# Altium schematic sheet MCU_CAN.SchDoc
size A; SheetNumber: 5; SheetTotal: 5
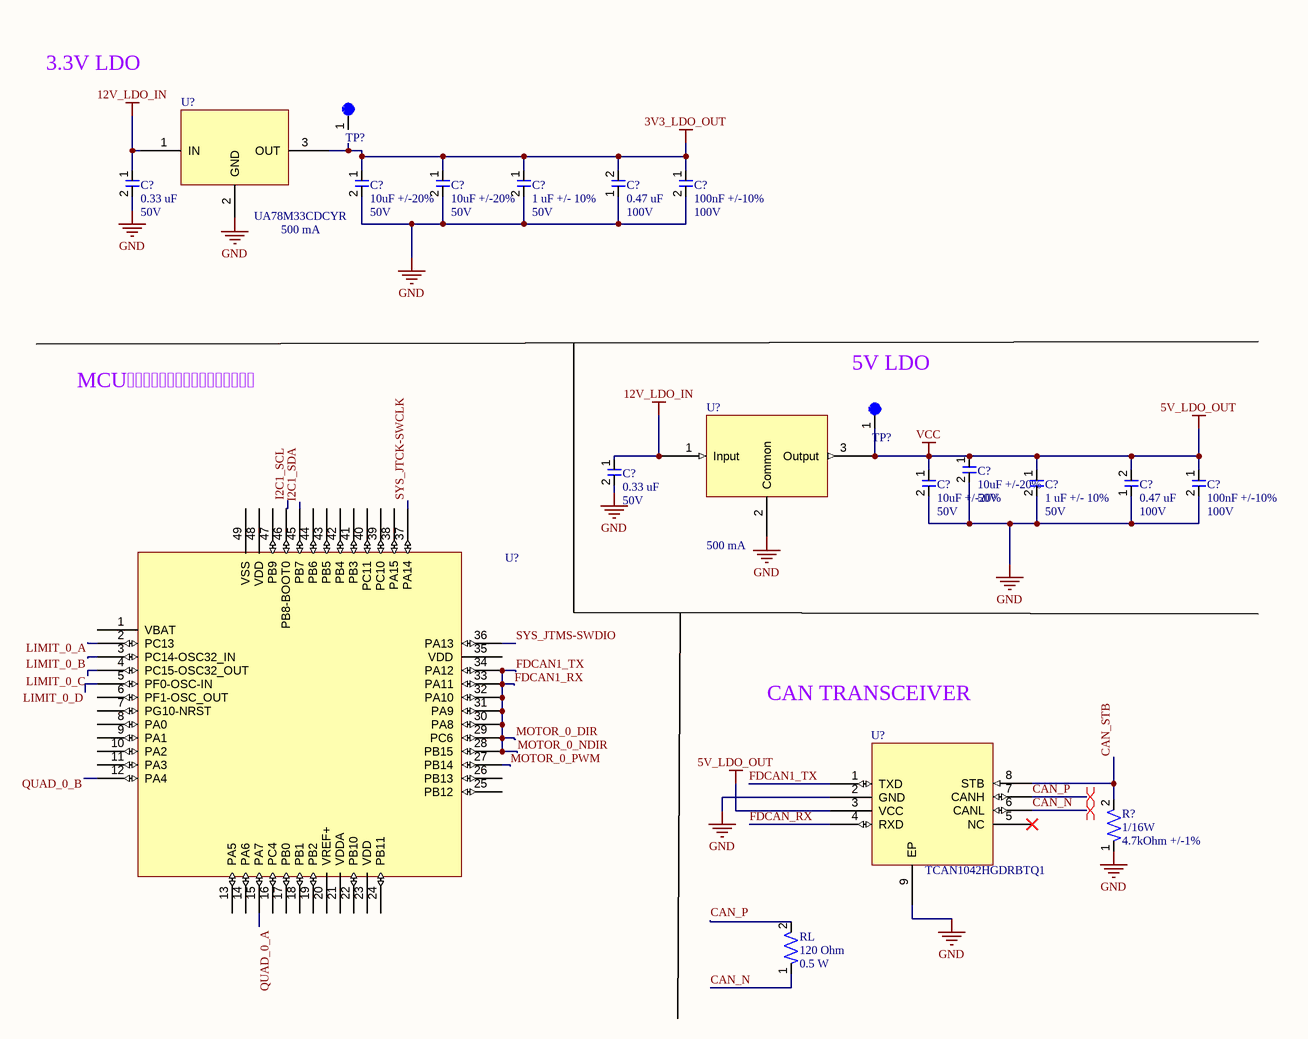
[diagram p0: MCU_CAN.SchDoc]

## Parts
(Parts that share a designator on the sheet are numbered #1, #2 ... from top to bottom, then left to right.)
C?#1  Capacitance: 0.33 uF  Voltage: 50V  [CAP-0603]  (hidden comment: CGA3E3X7R1H334K080AB)
C?#2  Capacitance: 10uF +/-20%  Voltage Rating: 50V  [CAP-1206]  (hidden comment: CL31B106KBHNNNE)
C?#3  Capacitance: 10uF +/-20%  Voltage Rating: 50V  [CAP-1206]  (hidden comment: CL31B106KBHNNNE)
C?#4  Cap: 1 uF +/- 10%  Voltage: 50V  [CAP-0805]  (hidden comment: GCM21BR71H105KA03L)
C?#5  Capacitance: 0.47 uF  Voltage: 100V  [CAP-0805]  (hidden comment: KAM21KR72A474KL)
C?#6  Capacitance: 100nF +/-10%  Voltage Rating: 100V  [CAP-0603]  (hidden comment: CC0603KRX7R0BB104)
C?#7  Capacitance: 0.33 uF  Voltage: 50V  [CAP-0603]  (hidden comment: CGA3E3X7R1H334K080AB)
C?#8  Capacitance: 10uF +/-20%  Voltage Rating: 50V  [CAP-1206]  (hidden comment: CL31B106KBHNNNE)
C?#9  Capacitance: 10uF +/-20%  Voltage Rating: 50V  [CAP-1206]  (hidden comment: CL31B106KBHNNNE)
C?#10  Cap: 1 uF +/- 10%  Voltage: 50V  [CAP-0805]  (hidden comment: GCM21BR71H105KA03L)
C?#11  Capacitance: 0.47 uF  Voltage: 100V  [CAP-0805]  (hidden comment: KAM21KR72A474KL)
C?#12  Capacitance: 100nF +/-10%  Voltage Rating: 100V  [CAP-0603]  (hidden comment: CC0603KRX7R0BB104)
R?  Power Rating: 1/16W  Resistance: 4.7kOhm +/-1%  [RES-0402]  (hidden comment: RC0402FR-074K7P)
RL  Resistance: 120 Ohm  Power: 0.5 W  [RES-1206]  (hidden comment: CRGH1206F120R)
TP?#1  5003  [TEST-POINT-0001]  (value not drawn)
TP?#2  5003  [TEST-POINT-0001]  (value not drawn)
U?#1  UA78M33CDCYR  Current: 500 mA  [IC-SOT-223-4]
U?#2  Current: 500 mA  [IC-SOT-223-4]  (hidden comment: UA78M05IDCYR)
U?#3  STM32G431CBU6  [MCU-UFQFPN48]  (value not drawn)
U?#4  TCAN1042HGDRBTQ1  [IC-8-VSON]

## Nets
3V3_LDO_OUT: C?#2.1 C?#3.1 C?#4.1 C?#5.2 C?#6.1 U?#1.3(OUT)
5V_LDO_OUT: C?#8.1 C?#9.1 C?#10.1 C?#11.2 C?#12.1 TP?#2.1 U?#2.3(Output) U?#4.3(VCC)  [also labelled VCC]
12V_LDO_IN: C?#1.1 C?#7.1 U?#1.1(IN) U?#2.1(Input)
GND: C?#1.2 C?#2.2 C?#3.2 C?#4.2 C?#5.1 C?#6.2 C?#7.2 C?#8.2 C?#9.2 C?#10.2 C?#11.1 C?#12.2 R?.1 U?#1.2(GND) U?#2.2(Common) U?#4.2(GND) U?#4.9(EP)
CAN_N: RL.1 U?#4.6(CANL)
CAN_P: RL.2 U?#4.7(CANH)
CAN_STB: R?.2 U?#4.8(STB)
FDCAN1_RX: U?#3.28(PB15) U?#3.29(PC6) U?#3.30(PA8) U?#3.31(PA9) U?#3.32(PA10) U?#3.33(PA11) U?#3.34(PA12) U?#4.1(TXD)  [also labelled FDCAN1_TX, MOTOR_0_DIR, MOTOR_0_NDIR]
FDCAN_RX: U?#4.4(RXD)
I2C1_SCL: U?#3.46(PB8-BOOT0)
I2C1_SDA: U?#3.45(PB7)
MOTOR_0_PWM: U?#3.27(PB14)
SYS_JTCK-SWCLK: U?#3.37(PA14)
SYS_JTMS-SWDIO: U?#3.36(PA13)

Not connected (* = marked no-connect by the designer): TP?#1 1(0); U?#3 1(VBAT) 2(PC13) 3(PC14-OSC32_IN) 4(PC15-OSC32_OUT) 5(PF0-OSC-IN) 6(PF1-OSC_OUT) 7(PG10-NRST) 8(PA0) 9(PA1) 10(PA2) 11(PA3) 12(PA4) 13(PA5) 14(PA6) 15(PA7) 16(PC4) 17(PB0) 18(PB1) 19(PB2) 20(VREF+) 21(VDDA) 22(PB10) 23(VDD) 24(PB11) 25(PB12) 26(PB13) 35(VDD) 38(PA15) 39(PC10) 40(PC11) 41(PB3) 42(PB4) 43(PB5) 44(PB6) 47(PB9) 48(VDD) 49(VSS); U?#4 5(NC)*

## Layout directives
differential pair: CAN_N, CAN_P

## Notes on the sheet
- 3.3V LDO
- (near TP?#2) 5V LDO
- MCU
- CAN TRANSCEIVER
- Labels drawn without touching a wire or pin: LIMIT_0_A, LIMIT_0_B, LIMIT_0_C, LIMIT_0_D, QUAD_0_A, QUAD_0_B
- DWG. NO.
- REV.
- SHT.
- THIS DOCUMENT AND THE DATA DISCLOSED HEREIN OR HEREWITH IS THE PROPERTY OF ALTIUM LIMITED AND MAY BE FREELY DISTRIBUTED IN WHOLE. NO RIGHTS ARE RESERVED OR EXPRESS OR IMPLIED WARANTEE GIVEN.
- REVISION
- DESCRIPTION
- DATE
- APPROVED
- ENG:
- APPROVALS
- PROJECT
- DSN:
- CHK:
- REFERENCE DOCUMENTS
- PROJECT REVISION:
- TITLE
- DOCUMENT REVISION:
- DESIGN ITEM:
- BOM:
- FAB DWG:
- PCB DWG:
- ASSY DWG:
- SCALE:
- SIZE
- B
- CAGE CODE
- FILE NAME
- DWG NO.
- SHEET
- OF
- REV

## Library data of the parts
C?#1 C?#7 = CAP-0.33uF-0001: 0.33 µF ±10% 50V Ceramic Capacitor X7R 0603 (1608 Metric); Manufacturer: TDK Corporation; Tolerance: +/- 10%; Manufacturer Part Number: CGA3E3X7R1H334K080AB; Temperature Coefficient: X7R
C?#2 C?#3 C?#8 C?#9 = CAP-10U-0001: 10 µF ±10% 50V Ceramic Capacitor X7R 1206 (3216 Metric); Manufacturer: Samsung Electro-Mechanics; Assembled?: no; Manufacturer Part Number: CL31B106KBHNNNE; Temperature Coefficient: X7R; Package Size: 1206
C?#4 C?#10 = CAP-1U-0003-JLC: 50V 1uF X7R ±10% 0805 Multilayer Ceramic Capacitors MLCC - SMD/SMT ROHS; assembled?: yes; JLC Part Number: C126592
C?#5 C?#11 = CAP-0.47U-0001: 0.47 µF ±10% 100V Ceramic Capacitor X7R 0805 (2012 Metric); Tolerance: +/- 10%; Assembled?: No; Temperature Coefficient: X7R; Package Size: 0805
C?#6 C?#12 = CAP-100N-0001: CAP CER 0.1UF 100V X7R 0603; Manufacturer: YAGEO; Assembled?: no; Manufacturer Part Number: CC0603KRX7R0BB104; Temperature Coefficient: X7R; Package Size: 0603
R? = RES-4.7K-0001: RES SMD 4.7K OHM 1% 1/16W 0402; Manufacturer: YAGEO; Assembled?: no; Manufacturer Part Number: RC0402FR-074K7P; Package Size: 0402
RL = RES-120-0002: 120 Ohms ±1% 0.5W, 1/2W Chip Resistor 1206 (3216 Metric) Thick Film; Tolerance: 1%; Package Size: 1206
TP?#1 TP?#2 = TEST-POINT-0001: Oranange PC Test Point, Miniature Phoisphor Bronze Silver Plating Through Hole Mounting Type
U?#1 = IC-LDO-3.3V-0002: Linear Voltage Regulator IC Positive Fixed 1 Output 500mA SOT-223-4; Vin: 25V; Vout: 3.3V; Package: SOT-223-4
U?#2 = IC-LDO-5V-0003: Linear Voltage Regulator IC Positive Fixed 1 Output 500mA SOT-223-4; Manufacturer: Texas Instruments; Assembled?: no; Manufacturer Part Number: UA78M05IDCYR; Package Size: SOT223-4; Type: Low dropout (LDO)
U?#3 = IC-STM32G431CBU6: 128KB 1.71V~3.6V ARM-MSeries 32KB 170MHz FLASH 42 UFQFPN-48(7x7) Microcontroller Units (MCUs/MPUs/SOCs) ROHS; Assembled?: no; Manufacturer Part Number: STM32G431CBU6; Package: UFQFPN-48
U?#4 = IC-CAN-TRANSCEIVER-0002: 1/1 Transceiver CANbus 8-VSON (3x3); Manufacturer: Texas Instrument; CAN Capability: FD-CAN; Manufacturer Part Number: TCAN1042HGDRBTQ1